# Altium project PCB_Project1.PrjPCB
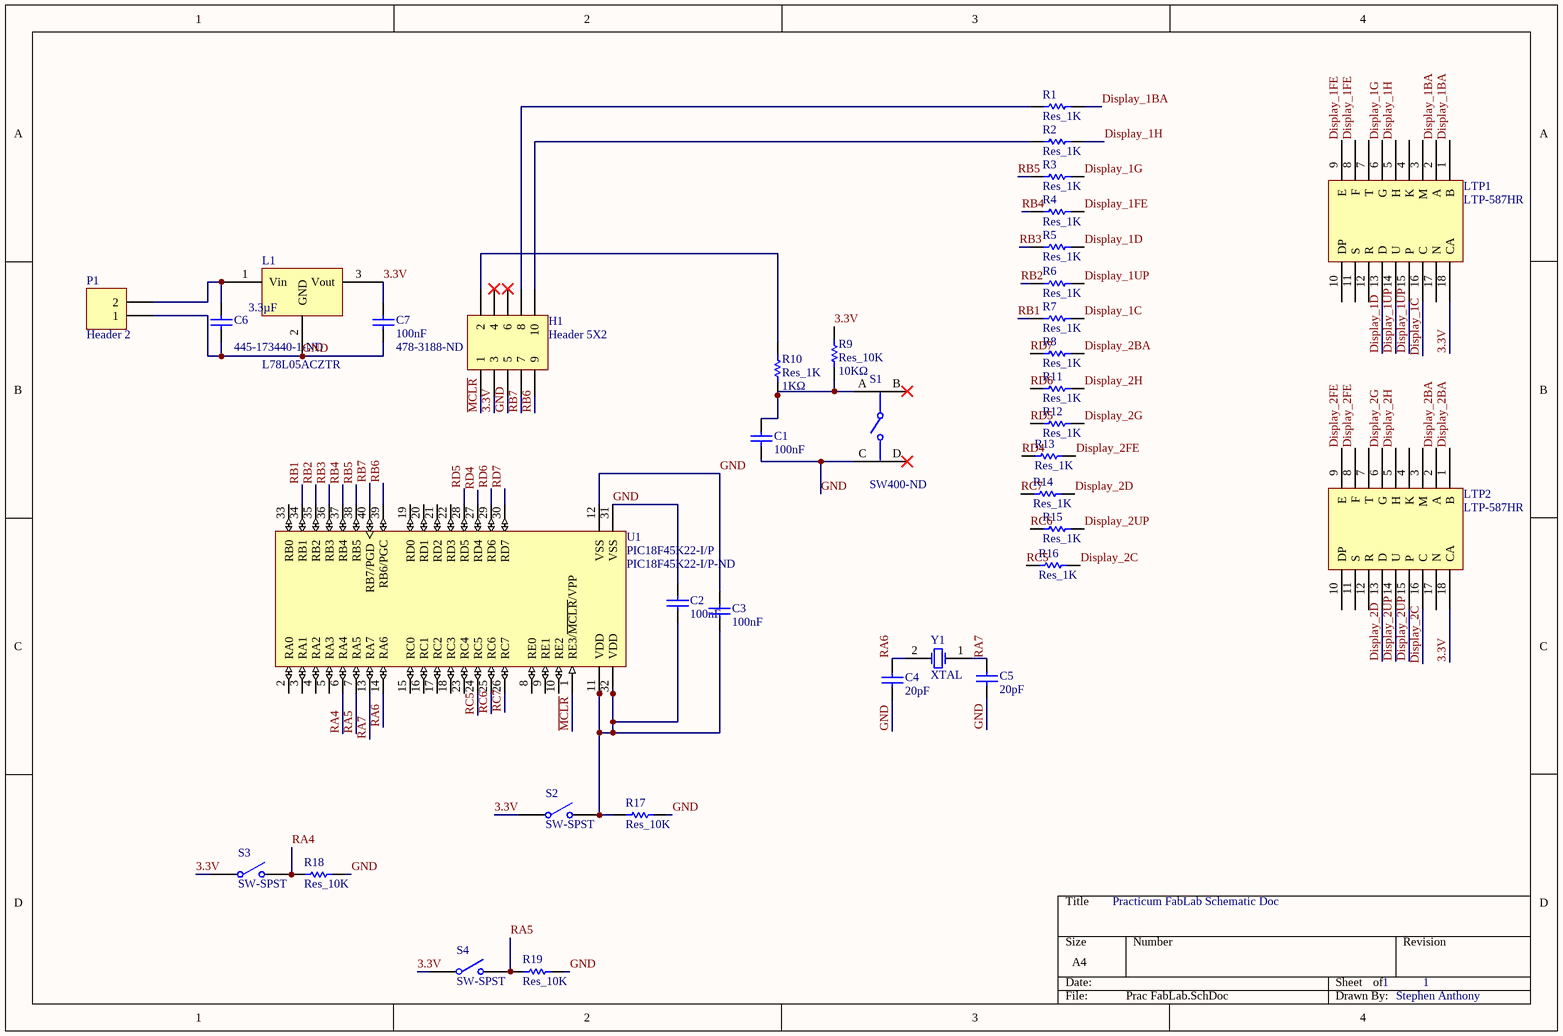
[diagram p0: Prac FabLab.SchDoc]
1 sheet, 37 parts. Net scope: global (net labels, ports and power ports of the same name join across sheets).
Board file: Prac FabLab.PcbDoc

## Sheet Prac FabLab.SchDoc
size A4

### Parts
C1  value 100nF  [RADIAL_0.2]  (hidden comment: CAP_100nF)
C2  value 100nF  [RADIAL_0.2]  (hidden comment: CAP_100nF)
C3  value 100nF  [RADIAL_0.2]  (hidden comment: CAP_100nF)
C4  value 20pF  [RADIAL_0.2]  (hidden comment: Capacitor)
C5  value 20pF  [RADIAL_0.2]  (hidden comment: Capacitor)
C6  value 3.3µF  Supplier Part Number 1: 445-173440-1-ND  [AXIAL_0.2]  (hidden comment: CAP_3.3µF)
C7  value 100nF  Supplier Part Number 1: 478-3188-ND  [AXIAL_0.2]  (hidden comment: CAP_100nF)
H1  Header 5X2  [HDR2X5]
L1  L78L05ACZTR  [TO-220-AB]
LTP1  LTP-587HR  [LTP-587HR_DIP18]
LTP2  LTP-587HR  [LTP-587HR_DIP18]
P1  Header 2  [HDR1X2]
R1  Res_1K  [AXIAL-0.3]
R2  Res_1K  [AXIAL-0.3]
R3  Res_1K  [AXIAL-0.3]
R4  Res_1K  [AXIAL-0.3]
R5  Res_1K  [AXIAL-0.3]
R6  Res_1K  [AXIAL-0.3]
R7  Res_1K  [AXIAL-0.3]
R8  Res_1K  [AXIAL-0.3]
R9  Res_10K  value 10KΩ  [AXIAL-0.3]
R10  Res_1K  value 1KΩ  [AXIAL-0.3]
R11  Res_1K  [AXIAL-0.3]
R12  Res_1K  [AXIAL-0.3]
R13  Res_1K  [AXIAL-0.3]
R14  Res_1K  [AXIAL-0.3]
R15  Res_1K  [AXIAL-0.3]
R16  Res_1K  [AXIAL-0.3]
R17  Res_10K  [AXIAL-0.3]
R18  Res_10K  [AXIAL-0.3]
R19  Res_10K  [AXIAL-0.3]
S1  Supplier Part Number 1: SW400-ND  [SW-SPST-1]
S2  SW-SPST  [SPST-2]
S3  SW-SPST  [SPST-2]
S4  SW-SPST  [SPST-2]
U1  PIC18F45K22-I/P  Supplier Part Number 1: PIC18F45K22-I/P-ND  [MCHP-PDIP-P40]
Y1  XTAL  [R38]

### Nets
3.3V: C7.2 H1.3 L1.3(Vout) LTP1.18(CA) LTP2.18(CA) R9.2 S2.1(COMMON) S3.1(COMMON) S4.1(COMMON)
Display_1BA: LTP1.1(B) LTP1.2(A) R1.2
Display_1C: LTP1.16(C) R7.2
Display_1D: LTP1.13(D) R5.2
Display_1FE: LTP1.8(F) LTP1.9(E) R4.2
Display_1G: LTP1.6(G) R3.2
Display_1H: LTP1.5(H) R2.2
Display_1UP: LTP1.14(U) LTP1.15(P) R6.2
Display_2BA: LTP2.1(B) LTP2.2(A) R8.2
Display_2C: LTP2.16(C) R16.2
Display_2D: LTP2.13(D) R14.2
Display_2FE: LTP2.8(F) LTP2.9(E) R13.2
Display_2G: LTP2.6(G) R12.2
Display_2H: LTP2.5(H) R11.2
Display_2UP: LTP2.14(U) LTP2.15(P) R15.2
GND: C1.2 C2.2 C3.2 C4.1 C5.1 C6.1 C7.1 H1.5 L1.2(GND) P1.1 R17.2 R18.2 R19.2 S1.C(NO) U1.12(VSS) U1.31(VSS)
~{MCLR}: H1.1 U1.1(RE3/~{MCLR}/VPP)
RA4: R18.1 S3.2(NO) U1.6(RA4)
RA5: R19.1 S4.2(NO) U1.7(RA5)
RA6: C4.2 U1.14(RA6) Y1.2(OSC2)
RA7: C5.2 U1.13(RA7) Y1.1(OSC1)
RB1: R7.1 U1.34(RB1)
RB2: R6.1 U1.35(RB2)
RB3: R5.1 U1.36(RB3)
RB4: R4.1 U1.37(RB4)
RB5: R3.1 U1.38(RB5)
RB6: H1.9 U1.39(RB6/PGC)
RB7: H1.7 U1.40(RB7/PGD)
RC5: R16.1 U1.24(RC5)
RC6: R15.1 U1.25(RC6)
RC7: R14.1 U1.26(RC7)
RD4: R13.1 U1.27(RD4)
RD5: R12.1 U1.28(RD5)
RD6: R11.1 U1.29(RD6)
RD7: R8.1 U1.30(RD7)
NetC1_1: C1.1 R9.1 R10.1 S1.A(COMMON)
NetC2_1: C2.1 C3.1 R17.1 S2.2(NO) U1.11(VDD) U1.32(VDD)
NetC6_2: C6.2 L1.1(Vin) P1.2
NetH1_2: H1.2 R10.2
NetH1_8: H1.8 R1.1
NetH1_10: H1.10 R2.1

Not connected (* = marked no-connect by the designer): H1 4* 6*; LTP1 3(M) 4(K) 7(T) 10(DP) 11(S) 12(R) 17(N); LTP2 3(M) 4(K) 7(T) 10(DP) 11(S) 12(R) 17(N); S1 B(COMMON)* D(NO)*; U1 2(RA0) 3(RA1) 4(RA2) 5(RA3) 8(RE0) 9(RE1) 10(RE2) 15(RC0) 16(RC1) 17(RC2) 18(RC3) 19(RD0) 20(RD1) 21(RD2) 22(RD3) 23(RC4) 33(RB0)

### Notes on the sheet
- Practicum FabLab Schematic Doc
- 1
- Stephen Anthony
- Title
- Size:
- Date:
- A4
- Number:
- Time:
- Revision:
- Sheet
- of
- File:

### Library data of the parts
C1-C3 C7 = CAP_100nF: Capacitor; Published: 8-Jun-2000; LatestRevisionDate: 17-Jul-2002; LatestRevisionNote: Re-released for DXP Platform.; PackageReference: RAD-0.3; Publisher: Altium Limited; PackageDescription: Radial Cap, Thru-Hole; 2 Leads; 0.3 in Pin Spacing; Supplier 1: Digi-Key
  C1-C3: Supplier Part Number 1: 478-3188-ND
C6 = CAP_3.3µF: Capacitor; Published: 8-Jun-2000; LatestRevisionDate: 17-Jul-2002; LatestRevisionNote: Re-released for DXP Platform.; PackageReference: RAD-0.3; Publisher: Altium Limited; PackageDescription: Radial Cap, Thru-Hole; 2 Leads; 0.3 in Pin Spacing; Supplier 1: Digi-Key
H1 = Header 5X2: Header, 5-Pin, Dual row; LatestRevisionDate: 17-Jul-2002; LatestRevisionNote: Re-released for DXP Platform.; Publisher: Altium Limited
LTP1 LTP2 = LTP-587HR: Character LED Display Module Red 16-Segment, Alphanumeric 1 Character Common Anode 2V 20mA 0.984" H x 0.630" W x 0.374" D (25.00mm x 16.00mm x 9.50mm) 18-DIP (0.500", 12.70mm)
P1 = Header 2: Header, 2-Pin; LatestRevisionDate: 17-Jul-2002; LatestRevisionNote: Re-released for DXP Platform.; Publisher: Altium Limited
R1-R8 R11-R16 = Res_1K: 1 kOhms ±1% 0.25W, 1/4W Through Hole Resistor Axial Flame Retardant Coating, Safety Metal Film; Value: 1KΩ; Published: 8-Jun-2000; LatestRevisionDate: 17-Jul-2002; LatestRevisionNote: Re-released for DXP Platform.; PackageReference: AXIAL-0.3; Publisher: Altium Limited; PackageDescription: Axial Device, Thru-Hole; 2 Leads; 0.3 in Pin Spacing; Supplier 1: Digi-Key; Supplier Part Number 1: RNF14FTD1K00CT-ND
R9 = Res_10K: 10 kOhms ±1% 0.25W, 1/4W Through Hole Resistor Axial Flame Retardant Coating, Safety Metal Film; Published: 8-Jun-2000; LatestRevisionDate: 17-Jul-2002; LatestRevisionNote: Re-released for DXP Platform.; PackageReference: AXIAL-0.3; Publisher: Altium Limited; PackageDescription: Axial Device, Thru-Hole; 2 Leads; 0.3 in Pin Spacing; Supplier 1: Digi-Key; Supplier Part Number 1: RNF14FTD10K0CT-ND
R10 = Res_1K: 1 kOhms ±1% 0.25W, 1/4W Through Hole Resistor Axial Flame Retardant Coating, Safety Metal Film; Published: 8-Jun-2000; LatestRevisionDate: 17-Jul-2002; LatestRevisionNote: Re-released for DXP Platform.; PackageReference: AXIAL-0.3; Publisher: Altium Limited; PackageDescription: Axial Device, Thru-Hole; 2 Leads; 0.3 in Pin Spacing; Supplier 1: Digi-Key; Supplier Part Number 1: RNF14FTD1K00CT-ND
R17-R19 = Res_1K: 1 kOhms ±1% 0.25W, 1/4W Through Hole Resistor Axial Flame Retardant Coating, Safety Metal Film; Value: 10KΩ; Published: 8-Jun-2000; LatestRevisionDate: 17-Jul-2002; LatestRevisionNote: Re-released for DXP Platform.; PackageReference: AXIAL-0.3; Publisher: Altium Limited; PackageDescription: Axial Device, Thru-Hole; 2 Leads; 0.3 in Pin Spacing; Supplier 1: Digi-Key; Supplier Part Number 1: RNF14FTD1K00CT-ND
S1 = SW-SPST_B3F-1000: Tactile Switch SPST-NO Top Actuated Through Hole; pin to pad: A>1 B>2 C>3 D>4; Published: 24-Mar-1999; LatestRevisionDate: 17-Jul-2002; LatestRevisionNote: Re-released for DXP Platform.; PackageReference: SPST-2; Publisher: Altium Limited; PackageDescription: Switch; 2 Leads; Supplier 1: Digi-Key
S2-S4 = SW-SPST: Single-Pole, Single-Throw Switch; Published: 24-Mar-1999; LatestRevisionDate: 17-Jul-2002; LatestRevisionNote: Re-released for DXP Platform.; PackageReference: SPST-2; Publisher: Altium Limited; PackageDescription: Switch; 2 Leads
U1 = PIC18F45K22-I/P: Low-Power, High-Performance Microcontroller with XLP Technology, 64 MHz, 35 I/O, -40 to 85 degC, 40-pin PDIP (P40), Tube; Manufacturer: Microchip; EEPROM Data Memory (bytes): 256; Internal Oscillator: 16 MHz, 31 kHz; Program Memory KWords: 16; I/O Pins: 35; RAM: 1536; Max. CPU Speed MHz: 64; Operation Voltage Range: 2.3V - 5.5V; Digital Communication: 2 -A/E/USART, 2 -MSSP(SPI/I2C); Timers: 3 - 8-bit, 4 - 16-bit; Program Memory KBytes: 32; # of A/D Channels: 28; Memory Type: Flash; PartNumber: PIC18F45K22-I/P; ComponentLink1Description: Datasheet; ComponentLink2Description: Package Specification; DatasheetVersion: Rev. F; ComponentLink3URL: Product URL:http://www.microchip.com/datasheet/PIC18F45K22; ComponentLink1URL: http://ww1.microchip.com/downloads/en/DeviceDoc/41412F.pdf; Packing: TUBE; ComponentLink2URL: http://www.microchip.com/stellent/groups/techpub_sg/documents/packagingspec/en012702.pdf; PackageReference: PDIP-P40; ComponentLink3Description: URL Link1; PackageVersion: C04-016B, 04/2013; RoHS: TRUE; Mounting Technology: Through Hole; PackageDescription: 40-Lead Plastic Dual In-Line Package, Body 51.75 x 13.53 mm, Pitch 2.54 mm; Supplier 1: Digi-Key
Y1 = XTAL: Crystal Oscillator; Published: 8-Jun-2000; LatestRevisionDate: 17-Jul-2002; LatestRevisionNote: Re-released for DXP Platform.; PackageReference: R38; Publisher: Altium Limited; PackageDescription: Crystal, Thru-Hole; 2 Leads; Body 3.1 x 8.2 mm (Dia.xH)
C4 C5 = Capacitor: Published: 8-Jun-2000; LatestRevisionDate: 17-Jul-2002; LatestRevisionNote: Re-released for DXP Platform.; PackageReference: RAD-0.3; Publisher: Altium Limited; PackageDescription: Radial Cap, Thru-Hole; 2 Leads; 0.3 in Pin Spacing